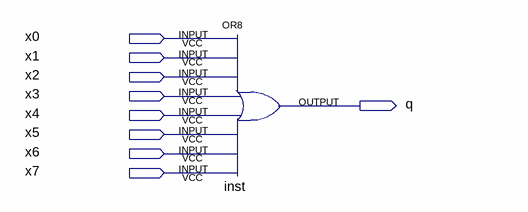
[diagram p0: schematic sheet]
// Quartus schematic or_8.bdf as structural Verilog: 1 symbols, 9 pins
module or_8 (
  input  x0,
  input  x1,
  input  x2,
  input  x3,
  input  x4,
  input  x5,
  input  x6,
  input  x7,
  output q
);

  or inst (q, x0, x1, x2, x3, x4, x5, x6, x7);
endmodule
